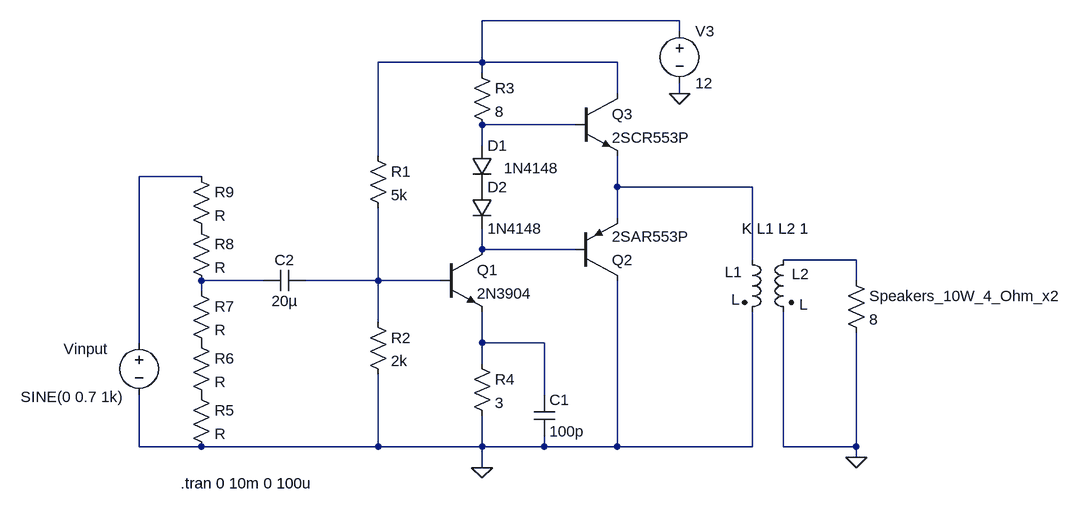
[diagram p0: schematic Final Module Design.asc]
Final Module Design.asc, the LTspice schematic file:
Version 4
SHEET 1 1140 680
WIRE 528 -224 224 -224
WIRE 528 -208 528 -224
WIRE 224 -160 224 -224
WIRE 224 -160 64 -160
WIRE 432 -160 224 -160
WIRE 224 -144 224 -160
WIRE 432 -112 432 -160
WIRE 528 -112 528 -128
WIRE 368 -64 224 -64
WIRE 224 -32 224 -64
WIRE 64 -16 64 -160
WIRE -208 16 -304 16
WIRE 432 32 432 -16
WIRE 640 32 432 32
WIRE 432 80 432 32
WIRE 224 128 224 96
WIRE 368 128 224 128
WIRE 640 144 640 32
WIRE 800 144 688 144
WIRE -112 176 -208 176
WIRE 64 176 64 64
WIRE 64 176 -48 176
WIRE 160 176 64 176
WIRE 800 176 800 144
WIRE -208 192 -208 176
WIRE 64 240 64 176
WIRE -304 272 -304 16
WIRE 224 272 224 224
WIRE 320 272 224 272
WIRE 224 304 224 272
WIRE 320 352 320 272
WIRE -304 432 -304 352
WIRE -208 432 -304 432
WIRE 64 432 64 320
WIRE 64 432 -208 432
WIRE 224 432 224 384
WIRE 224 432 64 432
WIRE 320 432 320 416
WIRE 320 432 224 432
WIRE 432 432 432 176
WIRE 432 432 320 432
WIRE 640 432 640 224
WIRE 640 432 432 432
WIRE 688 432 688 224
WIRE 800 432 800 256
WIRE 800 432 688 432
WIRE 800 448 800 432
WIRE 224 464 224 432
FLAG 224 464 0
FLAG 800 448 0
FLAG 528 -112 0
SYMBOL res 48 -32 R0
SYMATTR InstName R1
SYMATTR Value 5k
SYMBOL res 48 224 R0
SYMATTR InstName R2
SYMATTR Value 2k
SYMBOL res 208 288 R0
SYMATTR InstName R4
SYMATTR Value 3
SYMBOL cap 304 352 R0
SYMATTR InstName C1
SYMATTR Value 100p
SYMBOL cap -48 160 R90
WINDOW 0 0 32 VBottom 2
WINDOW 3 32 32 VTop 2
SYMATTR InstName C2
SYMATTR Value 20µ
SYMBOL voltage -304 256 R0
WINDOW 123 0 0 Left 0
WINDOW 39 0 0 Left 0
WINDOW 0 -116 25 Left 2
WINDOW 3 -182 99 Left 2
SYMATTR InstName Vinput
SYMATTR Value SINE(0 0.7 1k)
SYMBOL npn3 160 128 R0
SYMATTR InstName Q1
SYMATTR Value 2N3904
SYMBOL diode 208 -32 R0
WINDOW 3 50 35 Left 2
SYMATTR Value 1N4148
SYMATTR InstName D1
SYMBOL diode 208 32 R0
SYMATTR InstName D2
SYMATTR Value 1N4148
SYMBOL res 784 160 R0
SYMATTR InstName Speakers_10W_4_Ohm_x2
SYMATTR Value 8
SYMBOL voltage 528 -224 R0
WINDOW 123 0 0 Left 0
WINDOW 39 0 0 Left 0
SYMATTR InstName V3
SYMATTR Value 12
SYMBOL res 208 -160 R0
SYMATTR InstName R3
SYMATTR Value 8
SYMBOL pnp 368 176 M180
SYMATTR InstName Q2
SYMATTR Value 2SAR553P
SYMBOL npn 368 -112 R0
SYMATTR InstName Q3
SYMATTR Value 2SCR553P
SYMBOL ind2 624 128 R0
WINDOW 0 -26 35 Left 2
WINDOW 3 -16 77 Left 2
SYMATTR InstName L1
SYMATTR Type ind
SYMBOL ind2 704 128 M0
WINDOW 0 -24 38 Left 2
WINDOW 3 -22 85 Left 2
SYMATTR InstName L2
SYMATTR Type ind
SYMBOL res -224 336 R0
SYMATTR InstName R5
SYMBOL res -224 256 R0
SYMATTR InstName R6
SYMBOL res -224 176 R0
SYMATTR InstName R7
SYMBOL res -224 80 R0
SYMATTR InstName R8
SYMBOL res -224 0 R0
SYMATTR InstName R9
TEXT -240 488 Left 2 !.tran 0 10m 0 100u
TEXT 624 96 Left 2 !K L1 L2 1

The netlist it stands for:
* Final Module Design.asc
R1 N001 N008 5k
R2 N008 0 2k
R4 N009 0 3
C1 N009 0 100p
C2 N008 N007 20µ
Vinput N003 0 SINE(0 0.7 1k)
Q1 N005 N008 N009 0 2N3904
D1 N002 P001 1N4148
D2 P001 N005 1N4148
R§Speakers_10W_4_Ohm_x2 N006 0 8
V3 N001 0 12
R3 N001 N002 8
Q2 0 N005 N004 0 2SAR553P
Q3 N001 N002 N004 0 2SCR553P
L1 N004 0 L
L2 N006 0 L
R5 P002 0 R
R6 P003 P002 R
R7 N007 P003 R
R8 P004 N007 R
R9 N003 P004 R
.model D D
.lib standard.dio
.model NPN NPN
.model PNP PNP
.lib standard.bjt
.tran 0 10m 0 100u
K L1 L2 1
.backanno
.end